# EAGLE schematic IR (EAGLE 9.5.2)
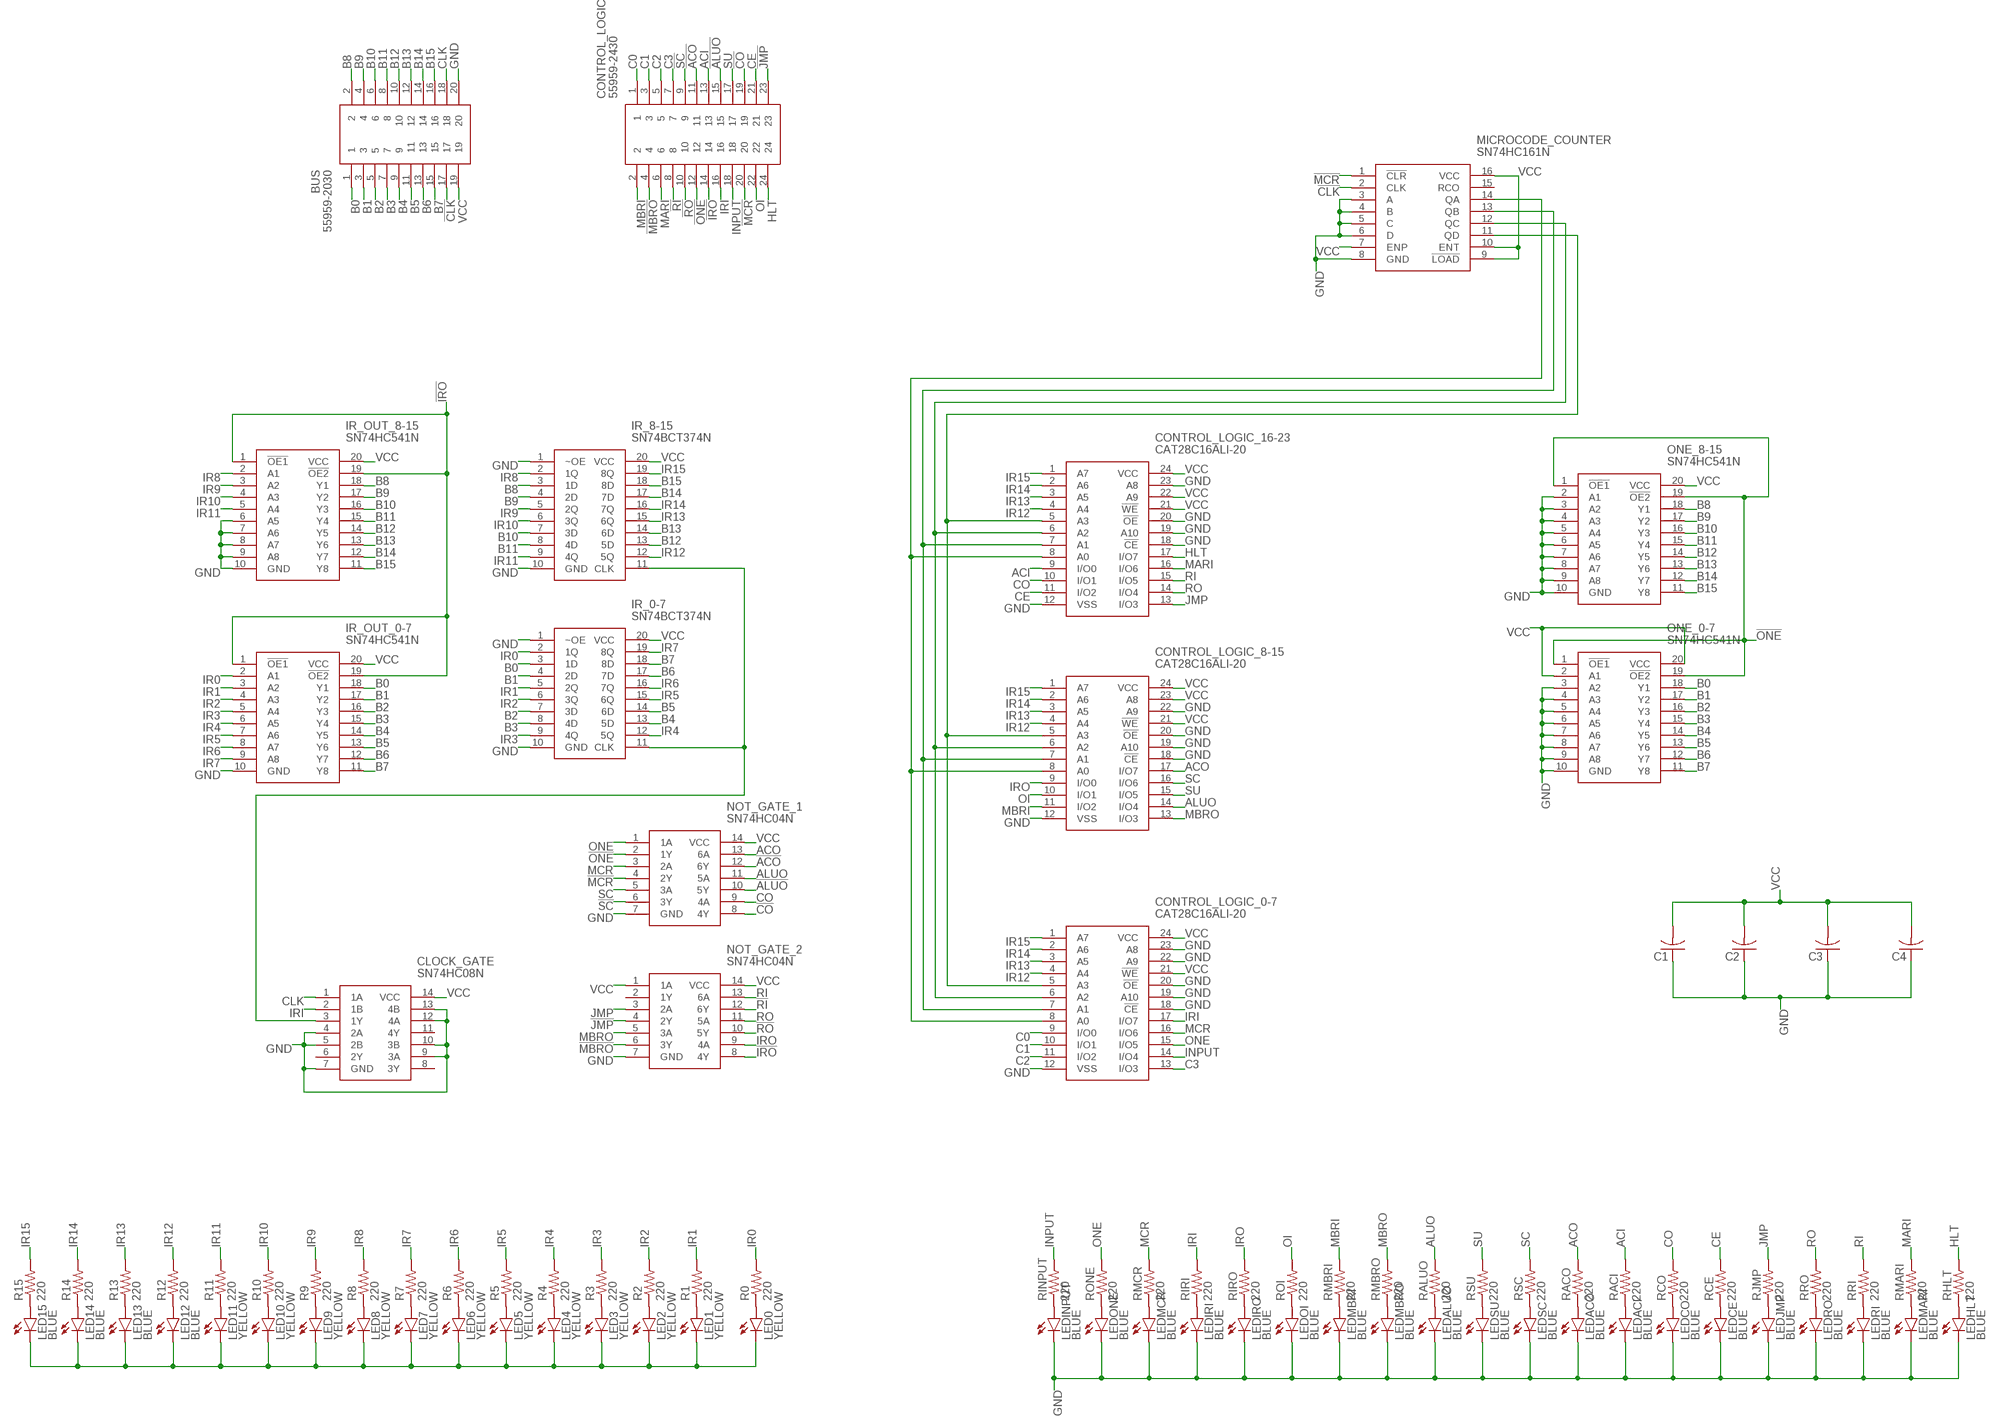
[diagram p0: schematic, sheet 1]

## Parts
BUS  55959-2030  [55959-2030_1]
C1  C-US025-024X044  [C025-024X044]
C2  C-US025-024X044  [C025-024X044]
C3  C-US025-024X044  [C025-024X044]
C4  C-US025-024X044  [C025-024X044]
CLOCK_GATE  SN74HC08N  [DIP794W53P254L1930H508Q14N]
CONTROL_LOGIC  55959-2430  [559592430]
CONTROL_LOGIC_0-7  CAT28C16ALI-20  [DIP1651W55P254L3188H635Q24N]
CONTROL_LOGIC_8-15  CAT28C16ALI-20  [DIP1651W55P254L3188H635Q24N]
CONTROL_LOGIC_16-23  CAT28C16ALI-20  [DIP1651W55P254L3188H635Q24N]
IR_0-7  SN74BCT374N  [DIP254P762X508-20]
IR_8-15  SN74BCT374N  [DIP254P762X508-20]
IR_OUT_0-7  SN74HC541N  [DIP794W53P254L2540H508Q20N]
IR_OUT_8-15  SN74HC541N  [DIP794W53P254L2540H508Q20N]
LED0  YELLOW  LED3MM  [LED3MM]
LED1  YELLOW  LED3MM  [LED3MM]
LED2  YELLOW  LED3MM  [LED3MM]
LED3  YELLOW  LED3MM  [LED3MM]
LED4  YELLOW  LED3MM  [LED3MM]
LED5  YELLOW  LED3MM  [LED3MM]
LED6  YELLOW  LED3MM  [LED3MM]
LED7  YELLOW  LED3MM  [LED3MM]
LED8  YELLOW  LED3MM  [LED3MM]
LED9  YELLOW  LED3MM  [LED3MM]
LED10  YELLOW  LED3MM  [LED3MM]
LED11  YELLOW  LED3MM  [LED3MM]
LED12  BLUE  LED3MM  [LED3MM]
LED13  BLUE  LED3MM  [LED3MM]
LED14  BLUE  LED3MM  [LED3MM]
LED15  BLUE  LED3MM  [LED3MM]
LEDACI  BLUE  LED3MM  [LED3MM]
LEDACO  BLUE  LED3MM  [LED3MM]
LEDALUO  BLUE  LED3MM  [LED3MM]
LEDCE  BLUE  LED3MM  [LED3MM]
LEDCO  BLUE  LED3MM  [LED3MM]
LEDHLT  BLUE  LED3MM  [LED3MM]
LEDINPUT  BLUE  LED3MM  [LED3MM]
LEDIRI  BLUE  LED3MM  [LED3MM]
LEDIRO  BLUE  LED3MM  [LED3MM]
LEDJMP  BLUE  LED3MM  [LED3MM]
LEDMARI  BLUE  LED3MM  [LED3MM]
LEDMBRI  BLUE  LED3MM  [LED3MM]
LEDMBRO  BLUE  LED3MM  [LED3MM]
LEDMCR  BLUE  LED3MM  [LED3MM]
LEDOI  BLUE  LED3MM  [LED3MM]
LEDONE  BLUE  LED3MM  [LED3MM]
LEDRI  BLUE  LED3MM  [LED3MM]
LEDRO  BLUE  LED3MM  [LED3MM]
LEDSC  BLUE  LED3MM  [LED3MM]
LEDSU  BLUE  LED3MM  [LED3MM]
MICROCODE_COUNTER  SN74HC161N  [DIP794W53P254L1930H508Q16N]
NOT_GATE_1  SN74HC04N  [DIP794W53P254L1930H508Q14N]
NOT_GATE_2  SN74HC04N  [DIP794W53P254L1930H508Q14N]
ONE_0-7  SN74HC541N  [DIP794W53P254L2540H508Q20N]
ONE_8-15  SN74HC541N  [DIP794W53P254L2540H508Q20N]
R0  220  R-US_0204/7  [0204/7]
R1  220  R-US_0204/7  [0204/7]
R2  220  R-US_0204/7  [0204/7]
R3  220  R-US_0204/7  [0204/7]
R4  220  R-US_0204/7  [0204/7]
R5  220  R-US_0204/7  [0204/7]
R6  220  R-US_0204/7  [0204/7]
R7  220  R-US_0204/7  [0204/7]
R8  220  R-US_0204/7  [0204/7]
R9  220  R-US_0204/7  [0204/7]
R10  220  R-US_0204/7  [0204/7]
R11  220  R-US_0204/7  [0204/7]
R12  220  R-US_0204/7  [0204/7]
R13  220  R-US_0204/7  [0204/7]
R14  220  R-US_0204/7  [0204/7]
R15  220  R-US_0204/7  [0204/7]
RACI  220  R-US_0204/7  [0204/7]
RACO  220  R-US_0204/7  [0204/7]
RALUO  220  R-US_0204/7  [0204/7]
RCE  220  R-US_0204/7  [0204/7]
RCO  220  R-US_0204/7  [0204/7]
RHLT  220  R-US_0204/7  [0204/7]
RINPUT  220  R-US_0204/7  [0204/7]
RIRI  220  R-US_0204/7  [0204/7]
RIRO  220  R-US_0204/7  [0204/7]
RJMP  220  R-US_0204/7  [0204/7]
RMARI  220  R-US_0204/7  [0204/7]
RMBRI  220  R-US_0204/7  [0204/7]
RMBRO  220  R-US_0204/7  [0204/7]
RMCR  220  R-US_0204/7  [0204/7]
ROI  220  R-US_0204/7  [0204/7]
RONE  220  R-US_0204/7  [0204/7]
RRI  220  R-US_0204/7  [0204/7]
RRO  220  R-US_0204/7  [0204/7]
RSC  220  R-US_0204/7  [0204/7]
RSU  220  R-US_0204/7  [0204/7]

## Nets
!ACO: CONTROL_LOGIC.11 NOT_GATE_1.12(6Y)
!ALUO: CONTROL_LOGIC.15 NOT_GATE_1.10(5Y)
!CLK: BUS.17 MICROCODE_COUNTER.2(CLK)
!CO: CONTROL_LOGIC.19 NOT_GATE_1.8(4Y)
!IRO: CONTROL_LOGIC.14 IR_OUT_0-7.1(!OE1) IR_OUT_0-7.19(!OE2) IR_OUT_8-15.1(!OE1) IR_OUT_8-15.19(!OE2) NOT_GATE_2.8(4Y)
!JMP: CONTROL_LOGIC.23 NOT_GATE_2.4(2Y)
!MBRO: CONTROL_LOGIC.4 NOT_GATE_2.6(3Y)
!MCR: CONTROL_LOGIC.20 MICROCODE_COUNTER.1(!CLR) NOT_GATE_1.4(2Y)
!ONE: CONTROL_LOGIC.12 NOT_GATE_1.2(1Y) ONE_0-7.1(!OE1) ONE_0-7.19(!OE2) ONE_8-15.1(!OE1) ONE_8-15.19(!OE2)
!RI: CONTROL_LOGIC.8 NOT_GATE_2.12(6Y)
!RO: CONTROL_LOGIC.10 NOT_GATE_2.10(5Y)
!SC: CONTROL_LOGIC.9 NOT_GATE_1.6(3Y)
ACI: CONTROL_LOGIC.13 CONTROL_LOGIC_16-23.9(I/O0) RACI.2
ACO: CONTROL_LOGIC_8-15.17(I/O7) NOT_GATE_1.13(6A) RACO.2
ALUO: CONTROL_LOGIC_8-15.14(I/O4) NOT_GATE_1.11(5A) RALUO.2
B0: BUS.1 IR_0-7.3(1D) IR_OUT_0-7.18(Y1) ONE_0-7.18(Y1)
B1: BUS.3 IR_0-7.4(2D) IR_OUT_0-7.17(Y2) ONE_0-7.17(Y2)
B2: BUS.5 IR_0-7.7(3D) IR_OUT_0-7.16(Y3) ONE_0-7.16(Y3)
B3: BUS.7 IR_0-7.8(4D) IR_OUT_0-7.15(Y4) ONE_0-7.15(Y4)
B4: BUS.9 IR_0-7.13(5D) IR_OUT_0-7.14(Y5) ONE_0-7.14(Y5)
B5: BUS.11 IR_0-7.14(6D) IR_OUT_0-7.13(Y6) ONE_0-7.13(Y6)
B6: BUS.13 IR_0-7.17(7D) IR_OUT_0-7.12(Y7) ONE_0-7.12(Y7)
B7: BUS.15 IR_0-7.18(8D) IR_OUT_0-7.11(Y8) ONE_0-7.11(Y8)
B8: BUS.2 IR_8-15.3(1D) IR_OUT_8-15.18(Y1) ONE_8-15.18(Y1)
B9: BUS.4 IR_8-15.4(2D) IR_OUT_8-15.17(Y2) ONE_8-15.17(Y2)
B10: BUS.6 IR_8-15.7(3D) IR_OUT_8-15.16(Y3) ONE_8-15.16(Y3)
B11: BUS.8 IR_8-15.8(4D) IR_OUT_8-15.15(Y4) ONE_8-15.15(Y4)
B12: BUS.10 IR_8-15.13(5D) IR_OUT_8-15.14(Y5) ONE_8-15.14(Y5)
B13: BUS.12 IR_8-15.14(6D) IR_OUT_8-15.13(Y6) ONE_8-15.13(Y6)
B14: BUS.14 IR_8-15.17(7D) IR_OUT_8-15.12(Y7) ONE_8-15.12(Y7)
B15: BUS.16 IR_8-15.18(8D) IR_OUT_8-15.11(Y8) ONE_8-15.11(Y8)
C0: CONTROL_LOGIC.1 CONTROL_LOGIC_0-7.9(I/O0)
C1: CONTROL_LOGIC.3 CONTROL_LOGIC_0-7.10(I/O1)
C2: CONTROL_LOGIC.5 CONTROL_LOGIC_0-7.11(I/O2)
C3: CONTROL_LOGIC.7 CONTROL_LOGIC_0-7.13(I/O3)
CE: CONTROL_LOGIC.21 CONTROL_LOGIC_16-23.11(I/O2) RCE.2
CLK: BUS.18 CLOCK_GATE.1(1A)
CO: CONTROL_LOGIC_16-23.10(I/O1) NOT_GATE_1.9(4A) RCO.2
GND: BUS.20 C1.1 C2.1 C3.1 C4.1 CLOCK_GATE.4(2A) CLOCK_GATE.5(2B) CLOCK_GATE.7(GND) CLOCK_GATE.9(3A) CLOCK_GATE.10(3B) CLOCK_GATE.12(4A) CLOCK_GATE.13(4B) CONTROL_LOGIC_0-7.12(VSS) CONTROL_LOGIC_0-7.18(!CE) CONTROL_LOGIC_0-7.19(A10) CONTROL_LOGIC_0-7.20(!OE) CONTROL_LOGIC_0-7.22(A9) CONTROL_LOGIC_0-7.23(A8) CONTROL_LOGIC_8-15.12(VSS) CONTROL_LOGIC_8-15.18(!CE) CONTROL_LOGIC_8-15.19(A10) CONTROL_LOGIC_8-15.20(!OE) CONTROL_LOGIC_8-15.22(A9) CONTROL_LOGIC_16-23.12(VSS) CONTROL_LOGIC_16-23.18(!CE) CONTROL_LOGIC_16-23.19(A10) CONTROL_LOGIC_16-23.20(!OE) CONTROL_LOGIC_16-23.23(A8) IR_0-7.1(~OE) IR_0-7.10(GND) IR_8-15.1(~OE) IR_8-15.10(GND) IR_OUT_0-7.10(GND) IR_OUT_8-15.6(A5) IR_OUT_8-15.7(A6) IR_OUT_8-15.8(A7) IR_OUT_8-15.9(A8) IR_OUT_8-15.10(GND) LEDACI.K(C) LEDACO.K(C) LEDALUO.K(C) LEDCE.K(C) LEDCO.K(C) LEDHLT.K(C) LEDINPUT.K(C) LEDIRI.K(C) LEDIRO.K(C) LEDJMP.K(C) LEDMARI.K(C) LEDMBRI.K(C) LEDMBRO.K(C) LEDMCR.K(C) LEDOI.K(C) LEDONE.K(C) LEDRI.K(C) LEDRO.K(C) LEDSC.K(C) LEDSU.K(C) MICROCODE_COUNTER.3(A) MICROCODE_COUNTER.4(B) MICROCODE_COUNTER.5(C) MICROCODE_COUNTER.6(D) MICROCODE_COUNTER.8(GND) NOT_GATE_1.7(GND) NOT_GATE_2.7(GND) ONE_0-7.3(A2) ONE_0-7.4(A3) ONE_0-7.5(A4) ONE_0-7.6(A5) ONE_0-7.7(A6) ONE_0-7.8(A7) ONE_0-7.9(A8) ONE_0-7.10(GND) ONE_8-15.2(A1) ONE_8-15.3(A2) ONE_8-15.4(A3) ONE_8-15.5(A4) ONE_8-15.6(A5) ONE_8-15.7(A6) ONE_8-15.8(A7) ONE_8-15.9(A8) ONE_8-15.10(GND)
HLT: CONTROL_LOGIC.24 CONTROL_LOGIC_16-23.17(I/O7) RHLT.2
INPUT: CONTROL_LOGIC.18 CONTROL_LOGIC_0-7.14(I/O4) RINPUT.2
IR0: IR_0-7.2(1Q) IR_OUT_0-7.2(A1) R0.2
IR1: IR_0-7.5(2Q) IR_OUT_0-7.3(A2) R1.2
IR2: IR_0-7.6(3Q) IR_OUT_0-7.4(A3) R2.2
IR3: IR_0-7.9(4Q) IR_OUT_0-7.5(A4) R3.2
IR4: IR_0-7.12(5Q) IR_OUT_0-7.6(A5) R4.2
IR5: IR_0-7.15(6Q) IR_OUT_0-7.7(A6) R5.2
IR6: IR_0-7.16(7Q) IR_OUT_0-7.8(A7) R6.2
IR7: IR_0-7.19(8Q) IR_OUT_0-7.9(A8) R7.2
IR8: IR_8-15.2(1Q) IR_OUT_8-15.2(A1) R8.2
IR9: IR_8-15.5(2Q) IR_OUT_8-15.3(A2) R9.2
IR10: IR_8-15.6(3Q) IR_OUT_8-15.4(A3) R10.2
IR11: IR_8-15.9(4Q) IR_OUT_8-15.5(A4) R11.2
IR12: CONTROL_LOGIC_0-7.4(A4) CONTROL_LOGIC_8-15.4(A4) CONTROL_LOGIC_16-23.4(A4) IR_8-15.12(5Q) R12.2
IR13: CONTROL_LOGIC_0-7.3(A5) CONTROL_LOGIC_8-15.3(A5) CONTROL_LOGIC_16-23.3(A5) IR_8-15.15(6Q) R13.2
IR14: CONTROL_LOGIC_0-7.2(A6) CONTROL_LOGIC_8-15.2(A6) CONTROL_LOGIC_16-23.2(A6) IR_8-15.16(7Q) R14.2
IR15: CONTROL_LOGIC_0-7.1(A7) CONTROL_LOGIC_8-15.1(A7) CONTROL_LOGIC_16-23.1(A7) IR_8-15.19(8Q) R15.2
IRI: CLOCK_GATE.2(1B) CONTROL_LOGIC.16 CONTROL_LOGIC_0-7.17(I/O7) RIRI.2
IRO: CONTROL_LOGIC_8-15.9(I/O0) NOT_GATE_2.9(4A) RIRO.2
JMP: CONTROL_LOGIC_16-23.13(I/O3) NOT_GATE_2.3(2A) RJMP.2
MARI: CONTROL_LOGIC.6 CONTROL_LOGIC_16-23.16(I/O6) RMARI.2
MBRI: CONTROL_LOGIC.2 CONTROL_LOGIC_8-15.11(I/O2) RMBRI.2
MBRO: CONTROL_LOGIC_8-15.13(I/O3) NOT_GATE_2.5(3A) RMBRO.2
MCR: CONTROL_LOGIC_0-7.16(I/O6) NOT_GATE_1.3(2A) RMCR.2
N$1: CONTROL_LOGIC_0-7.8(A0) CONTROL_LOGIC_8-15.8(A0) CONTROL_LOGIC_16-23.8(A0) MICROCODE_COUNTER.14(QA)
N$2: CONTROL_LOGIC_0-7.7(A1) CONTROL_LOGIC_8-15.7(A1) CONTROL_LOGIC_16-23.7(A1) MICROCODE_COUNTER.13(QB)
N$3: CONTROL_LOGIC_0-7.6(A2) CONTROL_LOGIC_8-15.6(A2) CONTROL_LOGIC_16-23.6(A2) MICROCODE_COUNTER.12(QC)
N$4: CONTROL_LOGIC_0-7.5(A3) CONTROL_LOGIC_8-15.5(A3) CONTROL_LOGIC_16-23.5(A3) MICROCODE_COUNTER.11(QD)
N$5: LEDINPUT.A RINPUT.1
N$6: LEDONE.A RONE.1
N$7: LEDMCR.A RMCR.1
N$8: LEDIRI.A RIRI.1
N$9: LEDIRO.A RIRO.1
N$10: LEDOI.A ROI.1
N$11: LEDMBRI.A RMBRI.1
N$12: LEDALUO.A RALUO.1
N$13: LEDSU.A RSU.1
N$14: LEDSC.A RSC.1
N$15: LEDCO.A RCO.1
N$16: LEDJMP.A RJMP.1
N$17: LEDRO.A RRO.1
N$18: LEDRI.A RRI.1
N$19: LEDMARI.A RMARI.1
N$20: LEDMBRO.A RMBRO.1
N$21: LEDACO.A RACO.1
N$22: LEDACI.A RACI.1
N$23: LEDCE.A RCE.1
N$24: LEDHLT.A RHLT.1
N$25: LED1.A R1.1
N$26: LED2.A R2.1
N$27: LED3.A R3.1
N$28: LED4.A R4.1
N$29: LED5.A R5.1
N$30: LED6.A R6.1
N$31: LED7.A R7.1
N$32: LED8.A R8.1
N$33: CLOCK_GATE.3(1Y) IR_0-7.11(CLK) IR_8-15.11(CLK)
N$34: LED9.A R9.1
N$35: LED10.A R10.1
N$36: LED11.A R11.1
N$37: LED12.A R12.1
N$38: LED13.A R13.1
N$39: LED14.A R14.1
N$40: LED15.A R15.1
N$41: LED0.A R0.1
N$42: LED0.K(C) LED1.K(C) LED2.K(C) LED3.K(C) LED4.K(C) LED5.K(C) LED6.K(C) LED7.K(C) LED8.K(C) LED9.K(C) LED10.K(C) LED11.K(C) LED12.K(C) LED13.K(C) LED14.K(C) LED15.K(C)
OI: CONTROL_LOGIC.22 CONTROL_LOGIC_8-15.10(I/O1) ROI.2
ONE: CONTROL_LOGIC_0-7.15(I/O5) NOT_GATE_1.1(1A) RONE.2
RI: CONTROL_LOGIC_16-23.15(I/O5) NOT_GATE_2.13(6A) RRI.2
RO: CONTROL_LOGIC_16-23.14(I/O4) NOT_GATE_2.11(5A) RRO.2
SC: CONTROL_LOGIC_8-15.16(I/O6) NOT_GATE_1.5(3A) RSC.2
SU: CONTROL_LOGIC.17 CONTROL_LOGIC_8-15.15(I/O5) RSU.2
VCC: BUS.19 C1.2 C2.2 C3.2 C4.2 CLOCK_GATE.14(VCC) CONTROL_LOGIC_0-7.21(!WE) CONTROL_LOGIC_0-7.24(VCC) CONTROL_LOGIC_8-15.21(!WE) CONTROL_LOGIC_8-15.23(A8) CONTROL_LOGIC_8-15.24(VCC) CONTROL_LOGIC_16-23.21(!WE) CONTROL_LOGIC_16-23.22(A9) CONTROL_LOGIC_16-23.24(VCC) IR_0-7.20(VCC) IR_8-15.20(VCC) IR_OUT_0-7.20(VCC) IR_OUT_8-15.20(VCC) MICROCODE_COUNTER.7(ENP) MICROCODE_COUNTER.9(!LOAD) MICROCODE_COUNTER.10(ENT) MICROCODE_COUNTER.16(VCC) NOT_GATE_1.14(VCC) NOT_GATE_2.1(1A) NOT_GATE_2.14(VCC) ONE_0-7.2(A1) ONE_0-7.20(VCC) ONE_8-15.20(VCC)
Unconnected: CLOCK_GATE.6(2Y) CLOCK_GATE.8(3Y) CLOCK_GATE.11(4Y) MICROCODE_COUNTER.15(RCO) NOT_GATE_2.2(1Y)

## Library data of the parts
BUS = SamacSys_Parts:55959-2030: Molex MICROCLASP Series, Series Number 56134, 2mm Pitch 20 Way 2 Row Right Angle PCB Header, Solder Termination, 3A Source: Datasheet <https://componentsearchengine.com/Datasheets/1/55959-2030.pdf>; DESCRIPTION: Molex MICROCLASP Series, Series Number 56134, 2mm Pitch 20 Way 2 Row Right Angle PCB Header, Solder Termination, 3A; HEIGHT: mm; MANUFACTURER_NAME: Molex; MANUFACTURER_PART_NUMBER: 55959-2030; MOUSER_PART_NUMBER: 538-55959-2030; MOUSER_PRICE-STOCK: https://www.mouser.com/Search/Refine.aspx?Keyword=538-55959-2030
C1-C4 = rcl:C-US: CAPACITOR, American symbol; SPICEPREFIX: C
CLOCK_GATE = SamacSys_Parts:SN74HC08N: QUADRUPLE 2-INPUT POSITIVE-NOR GATES Source: Datasheet <http://componentsearchengine.com/Datasheets/1/SN74HC08N.pdf>; DESCRIPTION: QUADRUPLE 2-INPUT POSITIVE-NOR GATES; HEIGHT: 5.08mm; MANUFACTURER_NAME: Texas Instruments; MANUFACTURER_PART_NUMBER: SN74HC08N; MOUSER_PART_NUMBER: 595-SN74HC08N; MOUSER_PRICE-STOCK: https://www.mouser.com/Search/Refine.aspx?Keyword=595-SN74HC08N
CONTROL_LOGIC = SamacSys_Parts:55959-2430: Headers & Wire Housings 24 Ckt R.A. Header Source: Datasheet <https://componentsearchengine.com/Datasheets/1/55959-2430.pdf>; DESCRIPTION: Headers & Wire Housings 24 Ckt R.A. Header; HEIGHT: 11.95mm; MANUFACTURER_NAME: Molex; MANUFACTURER_PART_NUMBER: 55959-2430; MOUSER_PART_NUMBER: 538-55959-2430; MOUSER_PRICE-STOCK: https://www.mouser.com/Search/Refine.aspx?Keyword=538-55959-2430
CONTROL_LOGIC_0-7 CONTROL_LOGIC_8-15 CONTROL_LOGIC_16-23 = SamacSys_Parts:CAT28C16ALI-20: 16 kb CMOS Parallel EEPROM Source: Datasheet <https://www.mouser.com/ProductDetail/ON-Semiconductor/CAT28C16ALI20?qs=YgVX8L7yMiuMp1BO4ER%2B7Q==>; DESCRIPTION: 16 kb CMOS Parallel EEPROM; HEIGHT: 6.35mm; MANUFACTURER_NAME: ON Semiconductor; MANUFACTURER_PART_NUMBER: CAT28C16ALI-20
IR_0-7 IR_8-15 = SamacSys_Parts:SN74BCT374N: OCTAL EDGE TRIGGERED D TYPE LATCHES Source: Datasheet; DESCRIPTION: OCTAL EDGE TRIGGERED D TYPE LATCHES; HEIGHT: mm; MANUFACTURER_NAME: Texas Instruments; MANUFACTURER_PART_NUMBER: SN74BCT374N; MOUSER_PART_NUMBER: 595-SN74BCT374N; MOUSER_PRICE-STOCK: https://www.mouser.com/Search/Refine.aspx?Keyword=595-SN74BCT374N
IR_OUT_0-7 IR_OUT_8-15 ONE_0-7 ONE_8-15 = SamacSys_Parts:SN74HC541N: Octal Buffers And Line Drivers With 3-State Outputs Source: Datasheet <http://componentsearchengine.com/Datasheets/3/SN74HC541N.pdf>; DESCRIPTION: Octal Buffers And Line Drivers With 3-State Outputs; HEIGHT: 5.08mm; MANUFACTURER_NAME: Texas Instruments; MANUFACTURER_PART_NUMBER: SN74HC541N; MOUSER_PART_NUMBER: 595-SN74HC541N; MOUSER_PRICE-STOCK: https://www.mouser.com/Search/Refine.aspx?Keyword=595-SN74HC541N
LED0 LED1-LED15 LEDACI LEDACO LEDALUO LEDCE LEDCO LEDHLT LEDINPUT LEDIRI LEDIRO LEDJMP LEDMARI LEDMBRI LEDMBRO LEDMCR LEDOI LEDONE LEDRI LEDRO LEDSC LEDSU = led:LED: LED OSRAM: - CHIPLED LG R971, LG N971, LY N971, LG Q971, LY Q971, LO R971, LY R971 LH N974, LH R974 LS Q976, LO Q976, LY Q976 LO Q996 - Hyper CHIPLED LW Q18S LB Q993, LB Q99A, LB R99A - SideLED LS A670, LO A670, LY A670, LG A670, LP A670 LB A673, LV A673, LT A673, LW A673 LH A674 LY A675 LS A676, LA A676, LO A676, LY A676, LW A676 LS A679, LY A679, LG A679 - Hyper Micro SIDELED® LS Y876, LA Y876, LO Y876, LY Y876 LT Y87S - SmartLED LW L88C, LW L88S LB L89C, LB L89S, LG L890 LS L89K, LO L89K, LY L89K LS L896, LA L896, LO L896, LY L896 - TOPLED LS T670, LO T670, LY T670, LG T670, LP T670 LSG T670, LSP T670, LSY T670, LOP T670, LYG T670 LG T671, LOG T671, LSG T671 LB T673, LV T673, LT T673, LW T673 LH T674 LS T676, LA T676, LO T676, LY T676, LB T676, LH T676, LSB T676, LW T676 LB T67C, LV T67C, LT T67C, LS T67K, LO T67K, LY T67K, LW E67C LS E67B, LA E67B, LO E67B, LY E67B, LB E67C, LV E67C, LT E67C LW T67C LS T679, LY T679, LG T679 LS T770, LO T770, LY T770, LG T770, LP T770 LB T773, LV T773, LT T773, LW T773 LH T774 LS E675, LA E675, LY E675, LS T675 LS T776, LA T776, LO T776, LY T776, LB T776 LHGB T686 LT T68C, LB T68C - Hyper Mini TOPLED® LB M676 - Mini TOPLED Santana® LG M470 LS M47K, LO M47K, LY M47K Source: http://www.osram.convergy.de LUXEON: - LUMILED® LXK2-PW12-R00, LXK2-PW12-S00, LXK2-PW14-U00, LXK2-PW14-V00 LXK2-PM12-R00, LXK2-PM12-S00, LXK2-PM14-U00 LXK2-PE12-Q00, LXK2-PE12-R00, LXK2-PE12-S00, LXK2-PE14-T00, LXK2-PE14-U00 LXK2-PB12-K00, LXK2-PB12-L00, LXK2-PB12-M00, LXK2-PB14-N00, LXK2-PB14-P00, LXK2-PB14-Q00 LXK2-PR12-L00, LXK2-PR12-M00, LXK2-PR14-Q00, LXK2-PR14-R00 LXK2-PD12-Q00, LXK2-PD12-R00, LXK2-PD12-S00 LXK2-PH12-R00, LXK2-PH12-S00 LXK2-PL12-P00, LXK2-PL12-Q00, LXK2-PL12-R00 Source: www.luxeon.com KINGBRIGHT: KA-3528ASYC Source: www.kingbright.com
MICROCODE_COUNTER = SamacSys_Parts:SN74HC161N: SYNCHRONOUS 4-BIT BINARY COUNTERS Source: Datasheet <http://www.ti.com/lit/gpn/sn74hc161>; DESCRIPTION: SYNCHRONOUS 4-BIT BINARY COUNTERS; HEIGHT: 5.08mm; MANUFACTURER_NAME: Texas Instruments; MANUFACTURER_PART_NUMBER: SN74HC161N; MOUSER_PART_NUMBER: 595-SN74HC161N; MOUSER_PRICE-STOCK: https://www.mouser.com/Search/Refine.aspx?Keyword=595-SN74HC161N
NOT_GATE_1 NOT_GATE_2 = SamacSys_Parts:SN74HC04N: Hex inverter,SN74HC04N DIP14 2.6V 25pcs Source: Datasheet <http://www.ti.com/lit/gpn/sn74hc04>; DESCRIPTION: Hex inverter,SN74HC04N DIP14 2.6V 25pcs; HEIGHT: 5.08mm; MANUFACTURER_NAME: Texas Instruments; MANUFACTURER_PART_NUMBER: SN74HC04N; MOUSER_PART_NUMBER: 595-SN74HC04N; MOUSER_PRICE-STOCK: https://www.mouser.com/Search/Refine.aspx?Keyword=595-SN74HC04N
R0 R1-R15 RACI RACO RALUO RCE RCO RHLT RINPUT RIRI RIRO RJMP RMARI RMBRI RMBRO RMCR ROI RONE RRI RRO RSC RSU = rcl:R-US_: RESISTOR, American symbol; SPICEPREFIX: R